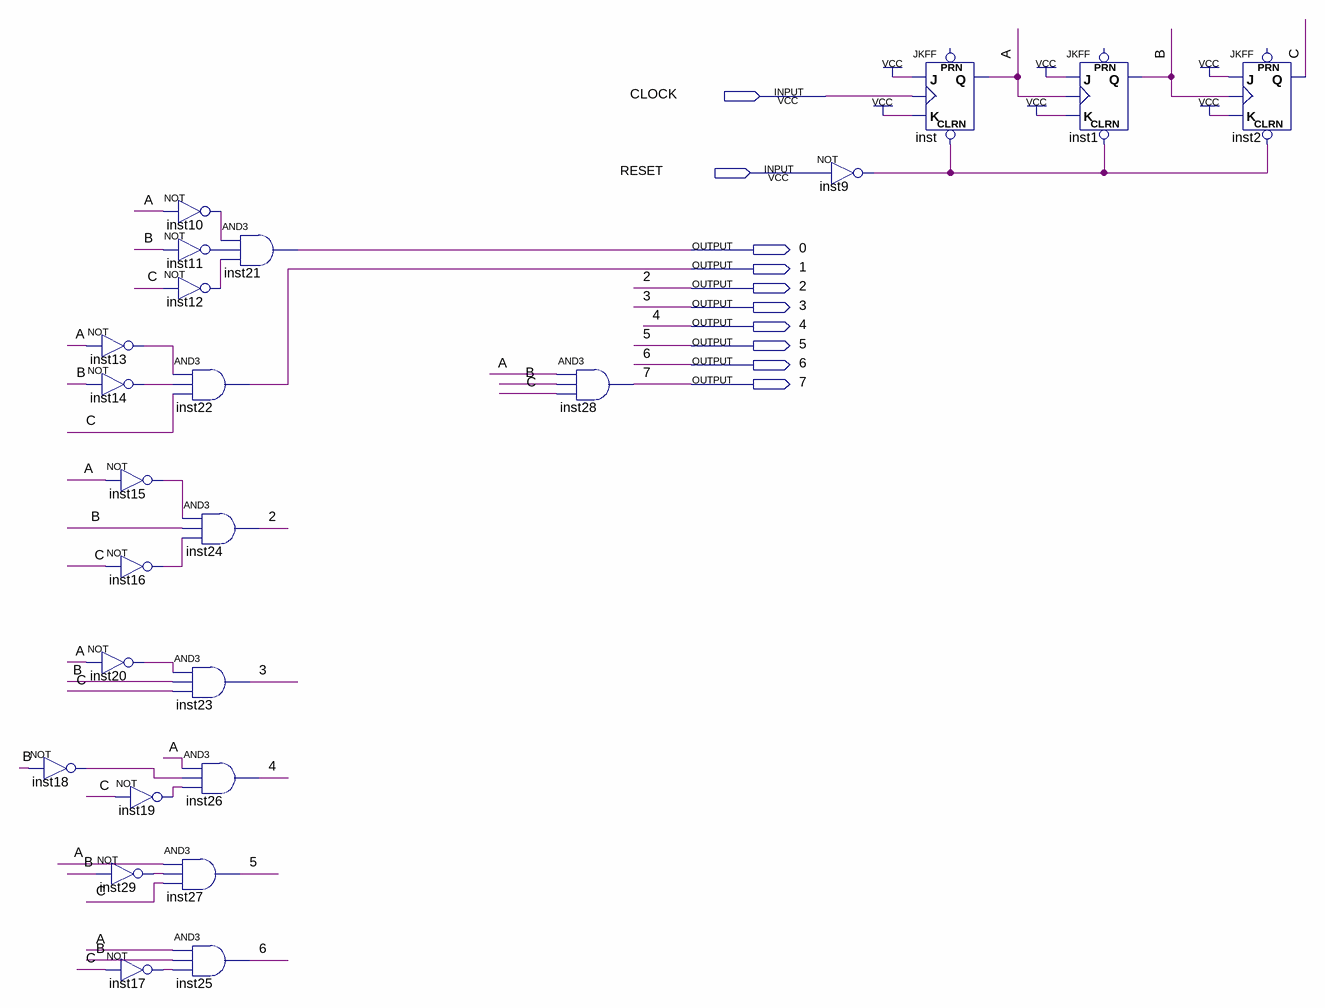
[diagram p0: schematic sheet]
// Quartus schematic contador.bdf as structural Verilog: 24 symbols, 10 pins
module contador (
  input  CLOCK,
  input  RESET,
  output \0 ,
  output \1 ,
  output \2 ,
  output \3 ,
  output \4 ,
  output \5 ,
  output \6 ,
  output \7 
);

  wire A, B, C, inst9_out, inst10_out, inst11_out, inst12_out, inst13_out, inst14_out, inst15_out,
       inst16_out, inst17_out, inst18_out, inst19_out, inst20_out, inst29_out;

  not inst13 (inst13_out, A);
  not inst14 (inst14_out, B);
  not inst20 (inst20_out, A);
  not inst18 (inst18_out, B);
  not inst29 (inst29_out, B);
  not inst10 (inst10_out, A);
  not inst11 (inst11_out, B);
  not inst12 (inst12_out, C);
  and inst22 (\1 , inst13_out, inst14_out, C);
  not inst15 (inst15_out, A);
  not inst16 (inst16_out, C);
  and inst23 (\3 , inst20_out, B, C);
  not inst19 (inst19_out, C);
  and inst27 (\5 , A, inst29_out, C);
  and inst25 (\6 , A, B, inst17_out);
  not inst17 (inst17_out, C);
  and inst21 (\0 , inst10_out, inst11_out, inst12_out);
  and inst24 (\2 , inst15_out, B, inst16_out);
  and inst26 (\4 , A, inst18_out, inst19_out);
  and inst28 (\7 , A, B, C);
  not inst9 (inst9_out, RESET);
  JKFF inst (.CLRN(inst9_out), .K(1'b1), .J(1'b1), .CLK(CLOCK), .Q(A));  // open: PRN
  JKFF inst1 (.CLRN(inst9_out), .K(1'b1), .J(1'b1), .CLK(A), .Q(B));  // open: PRN
  JKFF inst2 (.CLRN(inst9_out), .K(1'b1), .J(1'b1), .CLK(B), .Q(C));  // open: PRN
endmodule
